# EAGLE design Executive_12V_B (EAGLE 9.5.1)
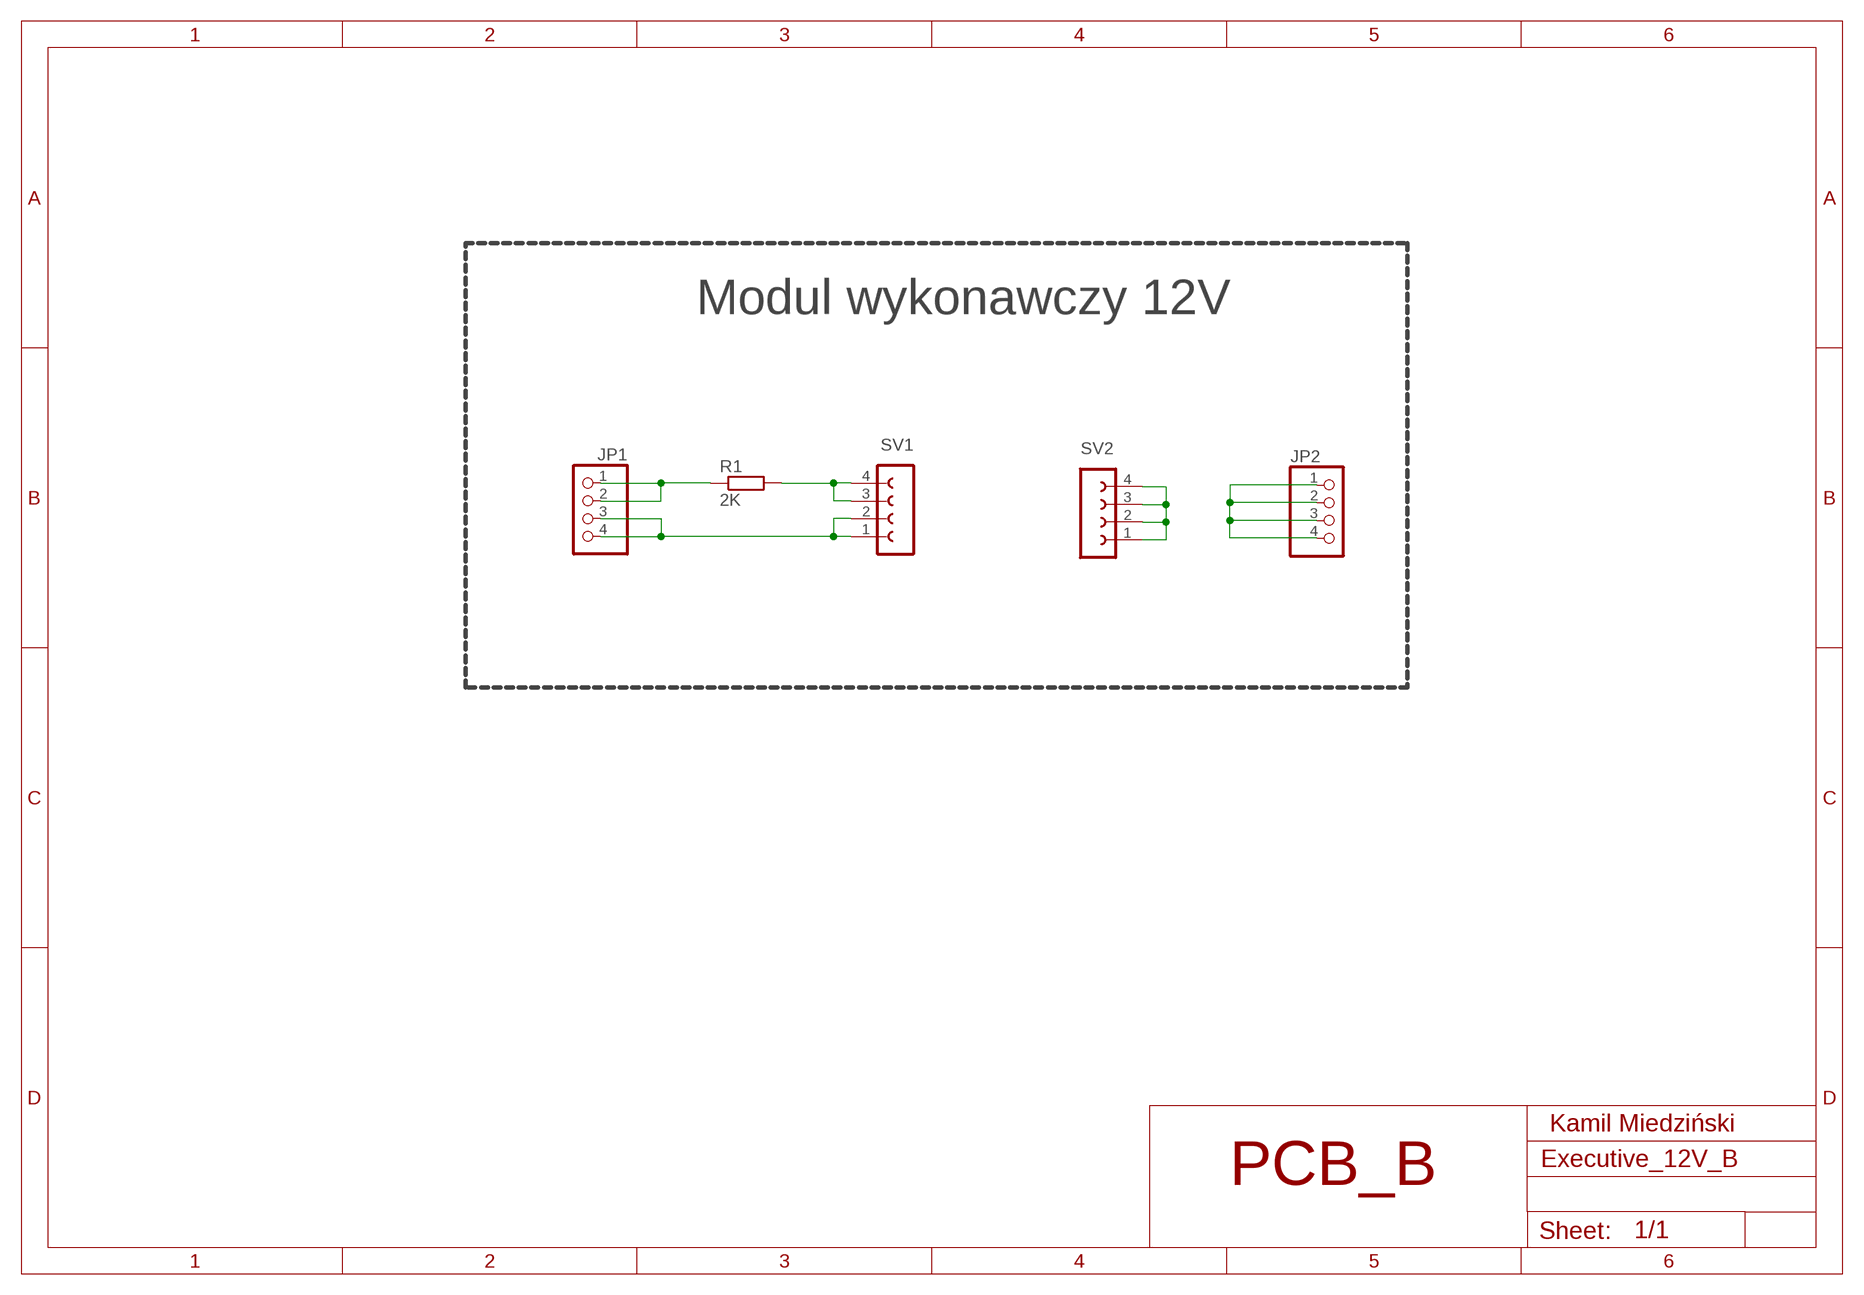
[diagram p0: schematic, sheet 1]

## Parts
JP1  PINHD-1X41X04H  [1X04H]
JP2  PINHD-1X41X04H  [1X04H]
R1  2K  R-EU_0207/10  [0207/10]
SV1  FE04-1  [FE04-1]
SV2  FE04-1  [FE04-1]

## Nets
N$1: JP1.3 JP1.4 SV1.1 SV1.2
N$2: JP1.1 JP1.2 R1.1
N$3: R1.2 SV1.3 SV1.4
N$4: SV2.1 SV2.2 SV2.3 SV2.4
N$9: JP2.1 JP2.2 JP2.3 JP2.4

## Notes on the sheet
- Modul wykonawczy 12V
- Kamil Miedziński
- PCB_B

## Library data of the parts
JP1 JP2 = pinhead:PINHD-1X4: PIN HEADER
R1 = rcl:R-EU_: RESISTOR, European symbol; OC_FARNELL: unknown; SPICEPREFIX: R
SV1 SV2 = con-lsta:FE04-1: FEMALE HEADER; OC_FARNELL: unknown; OC_NEWARK: unknown

## Board
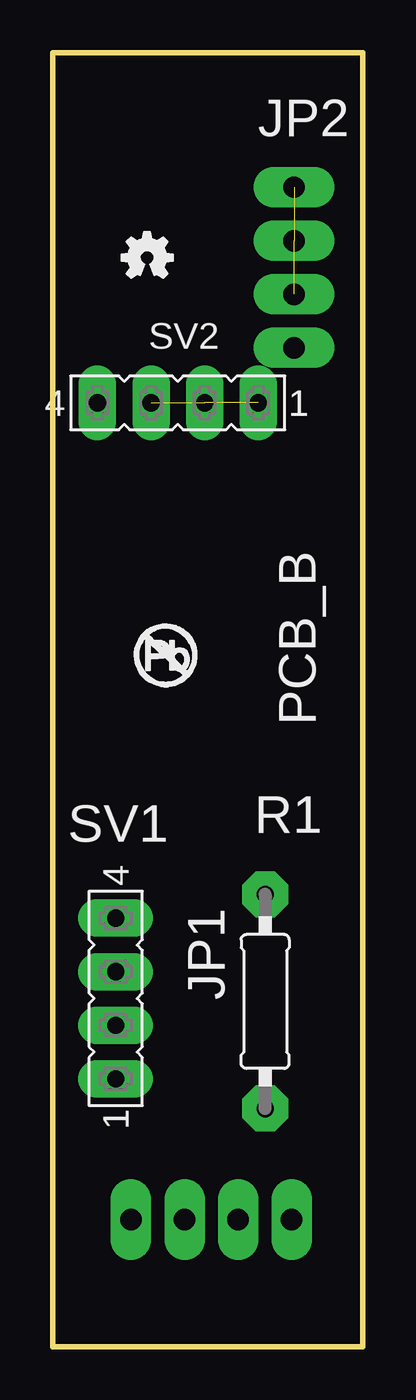
[diagram p1: board, top side]
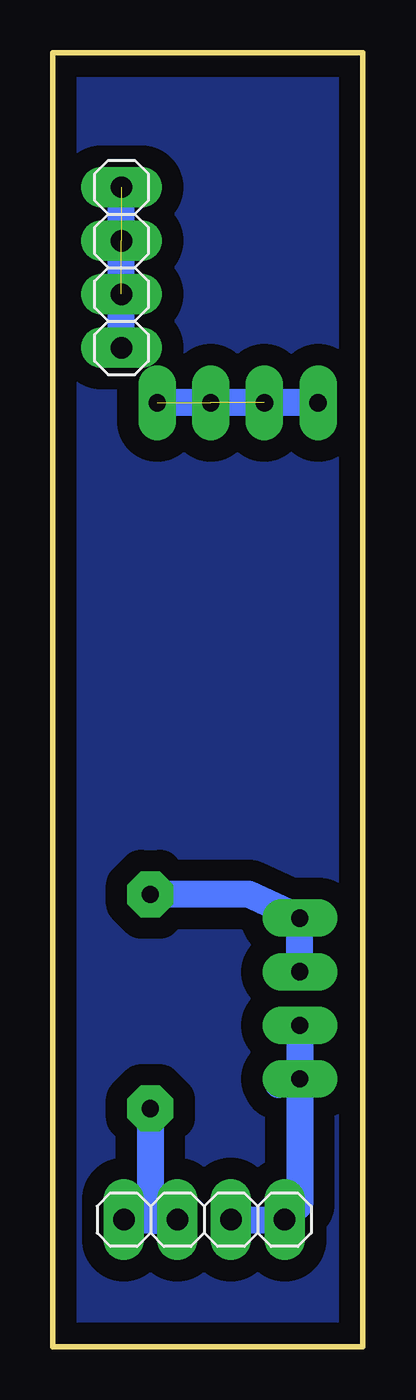
[diagram p2: board, bottom side, seen from below]

Size 14.7 x 61.38 mm. Coordinates in mm from the lower left corner, seen from the top.
Outline: 0,0 14.7,0 14.7,61.38 0,61.38 0,0
Copper layers (1*16): Top 0.035mm / dielectric 1.5mm / Bottom 0.035mm
Design rules "default": minimum track width 6mil, minimum drill 0.35mm, track to track 6mil, track to pad 6mil, pad to pad 6mil, via to via 6mil, smd to smd 6mil, copper to edge 40mil, drill to drill 6mil, minimum pad ring 10mil, minimum via ring 8mil, stop-mask expansion 4mil, vias tented up to drill 0mil, thermal gap 10mil

### Footprints (pad centres in the part's own frame; a part is rotated, then mirrored left to right if it is on the bottom)
1X04H = drill 1.016 pad 1.93 long: 1 -3.81,0; 2 -1.27,0; 3 1.27,0; 4 3.81,0
0207/10 = drill 0.813 pad 2.184 octagon: 1 -5.08,0; 2 5.08,0
FE04-1 = drill 0.813 pad 1.778 long: 1 -3.81,0; 2 -1.27,0; 3 1.27,0; 4 3.81,0

### Placement (x,y rotation side)
JP1  7.52,6.03 0 bottom
JP2  11.44,51.19 90 bottom
R1  10.07,16.38 90 top
SV1  2.98,16.52 90 top
SV2  5.93,44.77 180 top
U$1  [OSHW-LOGO-MINI]  4.48,51.67 0 top
U$2  [NO_PB_LOGO_0.120]  3.63,30.89 0 top

### Tracks (layer width: path | path; a pad name or v marks a point on that pad's centre or on a via)
N$1
  Bottom 1.27: JP1.3 JP1.4 | 4,12.43 SV1.1 3,12.69 | 4,6.32 JP1.4 | JP1.4 3,6.74 3,12.69 | SV1.2 3,15.23 3,12.69
N$2
  Bottom 1.27: R1.1 10.07,6.07 | 10.07,6.07 10,6 8.82,6 JP1.2 | JP1.1 10.11,6.03 10.07,6.07
N$3
  Bottom 1.27: SV1.3 SV1.4 5.41,21.46 R1.2
N$4  (2 unrouted)
  Bottom 1.27: SV2.4 SV2.1
N$7
  pour Bottom (isolate 1.016): 0,61.38 0,0 14.7,0 14.7,61.38
N$9  (2 unrouted)
  Bottom 1.27: JP2.1 JP2.4

### Text on the board
tNames: PCB_B